# EasyEDA schematic SCH_IR BEam Sensor_2023-01-03.json
TITLE: IR Beam Sensor; REV: 1.0; Date: 2022-12-27; Sheet: 1/1; Drawn By: sygad1; Company: N/A
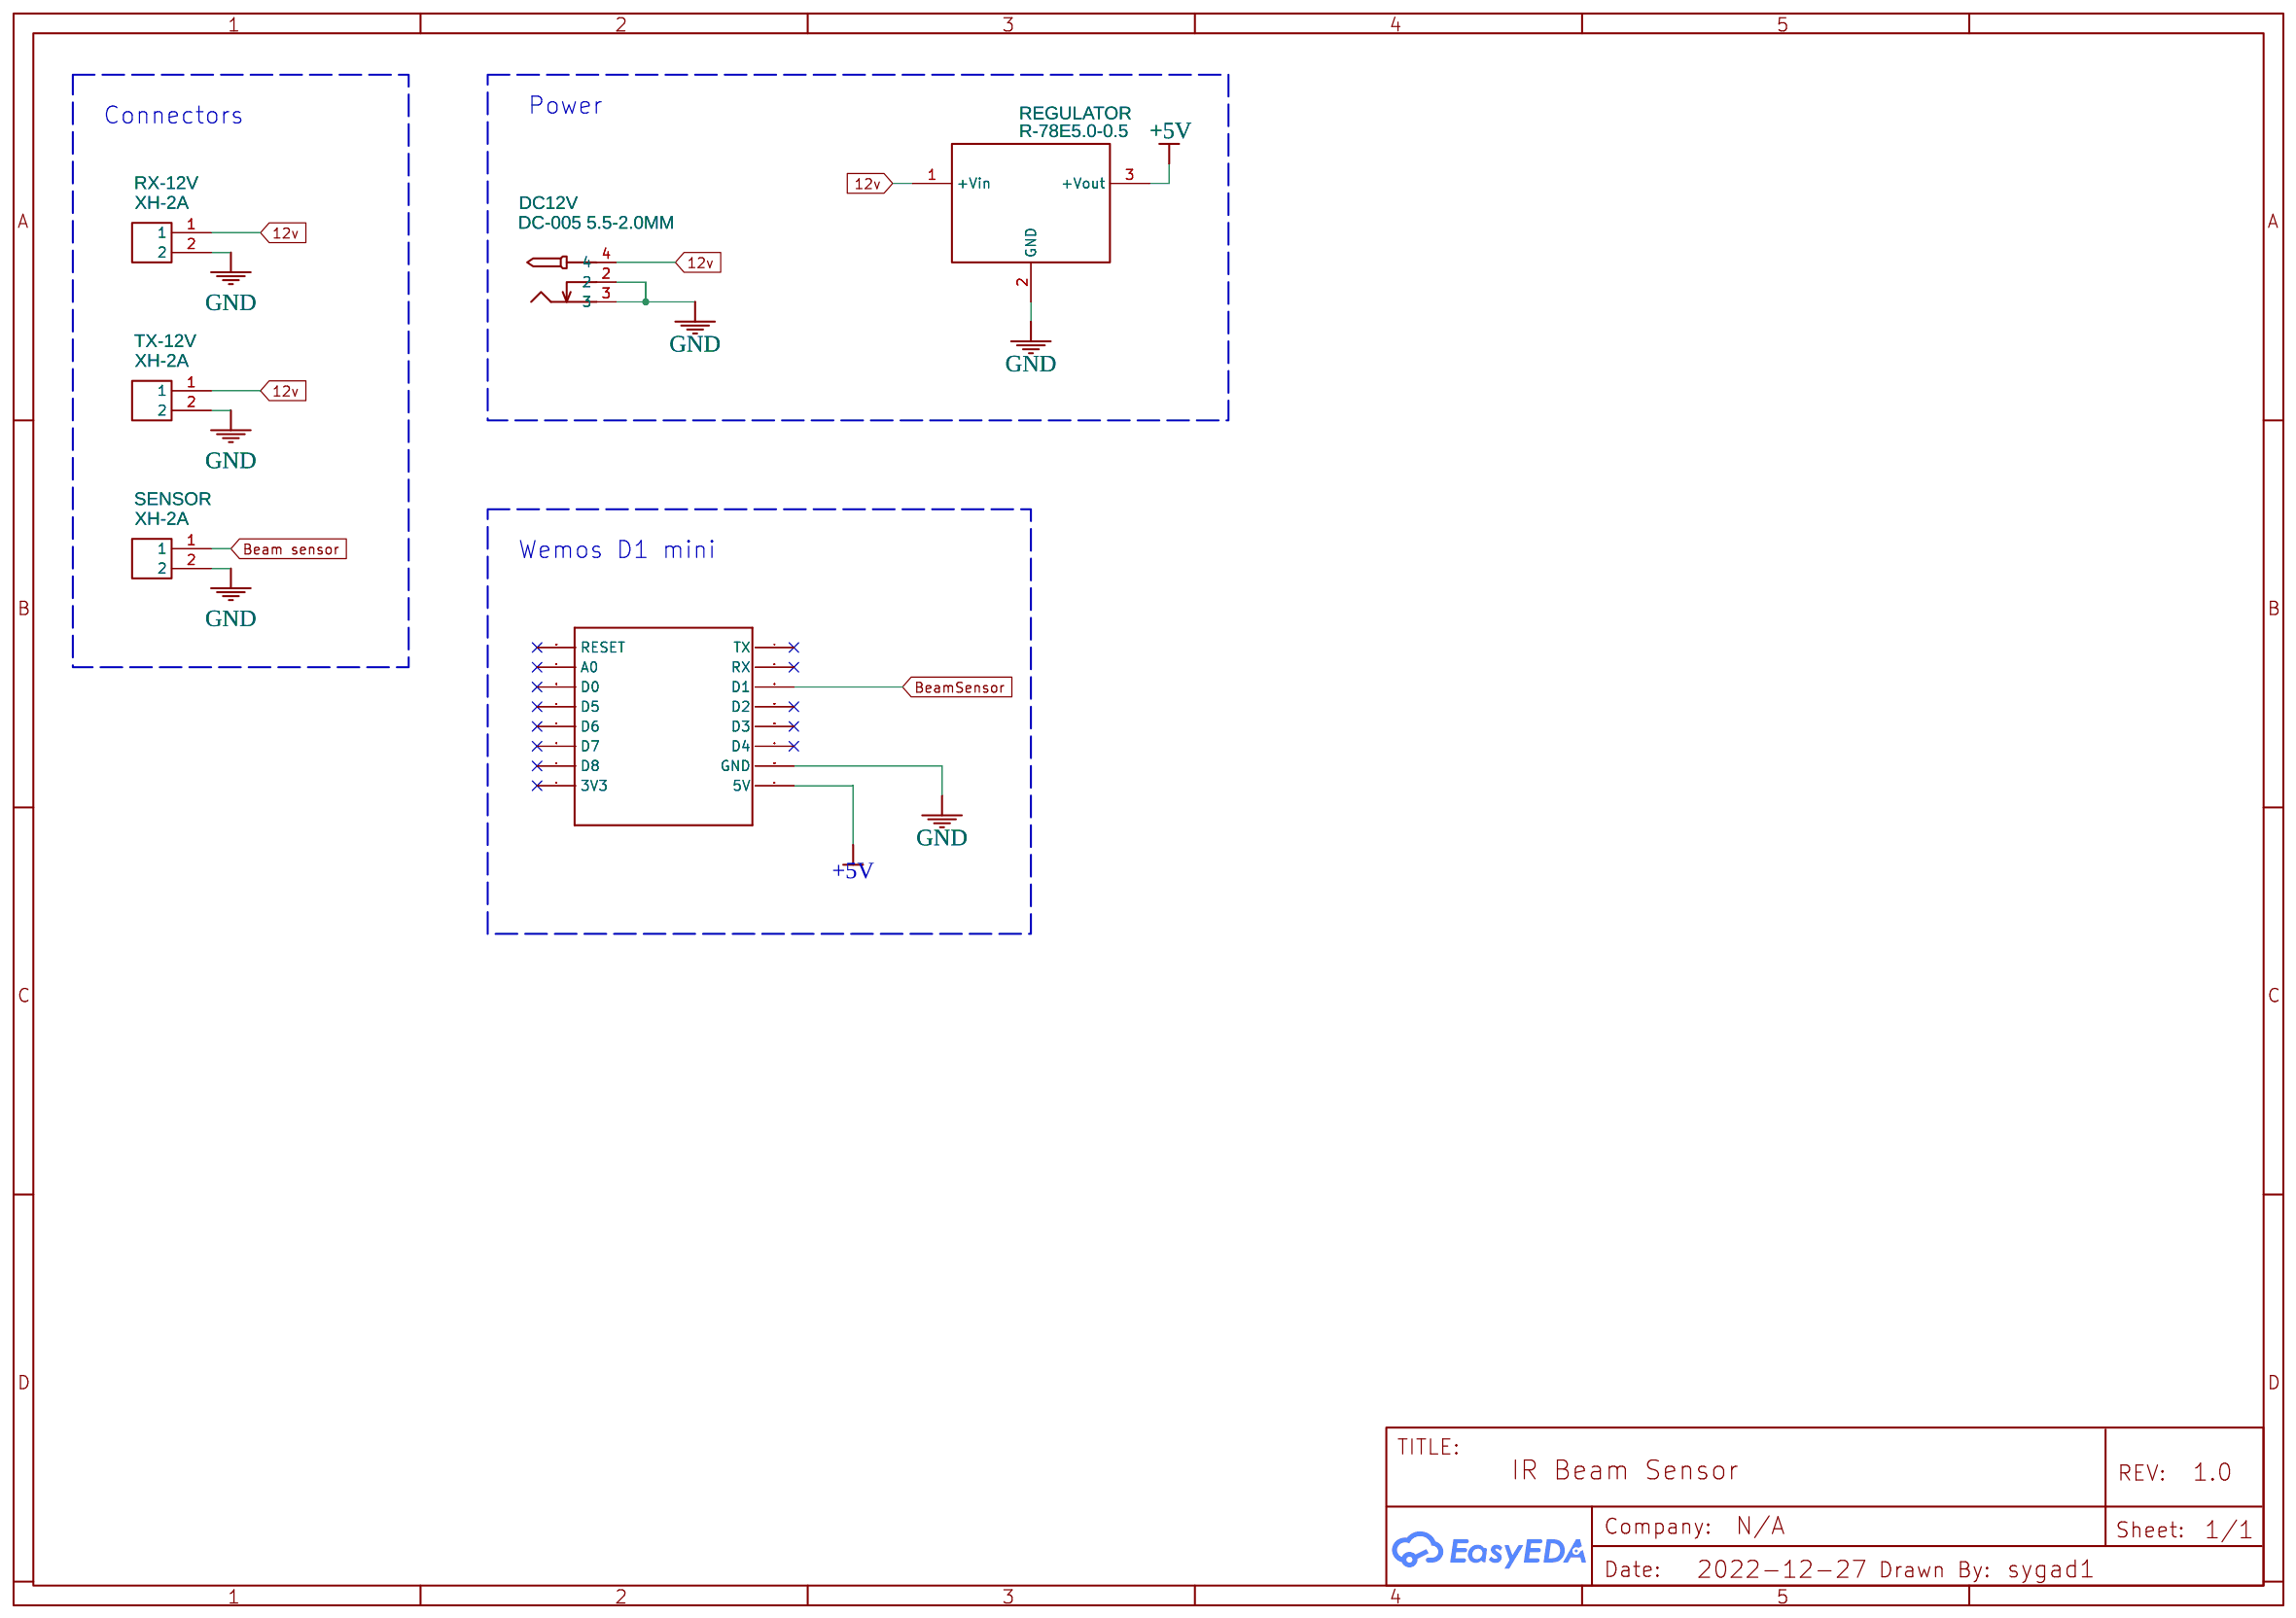
[diagram p0: schematic sheet]

## Parts
DC12V  DC-005 5.5-2.0MM  [DC-IN-TH_DC-5520-1]
REGULATOR  R-78E5.0-0.5  [R-78E5.0-0.5]
RX-12V  XH-2A  [CONN-TH_XH-2A]
SENSOR  XH-2A  [CONN-TH_XH-2A]
TX-12V  XH-2A  [CONN-TH_XH-2A]
WEMOS1  WEMOS-D1-MINI  [WEMOS-D1-MINI]

## Library data of the parts
DC12V = DC-005 5.5-2.0MM: Supplier: LCSC; Manufacturer: BOOMELE; Supplier Part: C16214; JLCPCB Part Class: Extended Part
REGULATOR = R-78E5.0-0.5: Manufacturer: Recom Power; Supplier: Digi-Key; Supplier Part: 945-1648-5-ND; Contributor: AQUAMOX
RX-12V SENSOR TX-12V = XH-2A: Supplier: LCSC; Manufacturer: BOOMELE; Supplier Part: C20079; JLCPCB Part Class: Extended Part
WEMOS1 = WEMOS-D1-MINI: Contributor: Fabian1599

## Nets
12v: DC12V.4 REGULATOR.1(+Vin) RX-12V.1 TX-12V.1
+5V: REGULATOR.3(+Vout) WEMOS1.5V
GND: DC12V.2 DC12V.3 REGULATOR.2(GND) RX-12V.2 SENSOR.2 TX-12V.2 WEMOS1.GND
Beam sensor: SENSOR.1
BeamSensor: WEMOS1.D1

Not connected (* = marked no-connect by the designer): WEMOS1 3V3* A0* D0* D2* D3* D4* D5* D6* D7* D8* RESET* RX* TX*

## Notes on the sheet
- Connectors
- Power
- Wemos D1 mini
